# EAGLE schematic 8_RGB_SMD_LEDs (EAGLE 6.4)
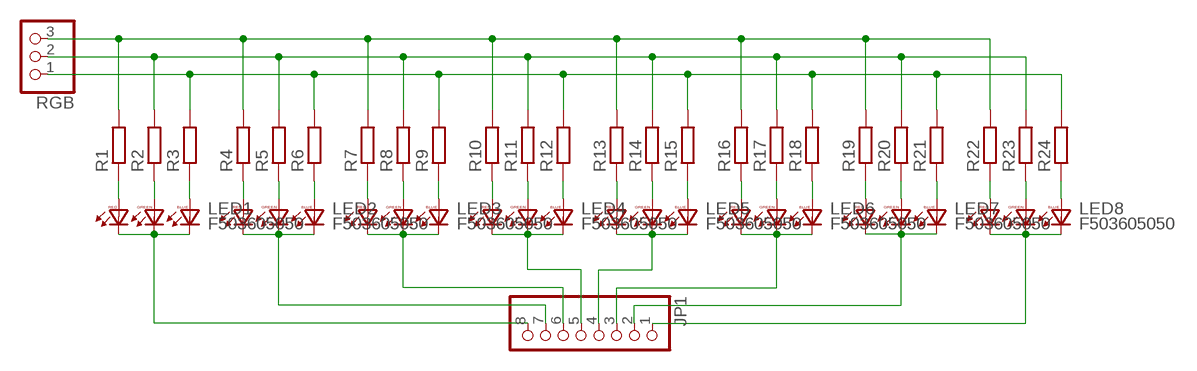
[diagram p0: schematic, sheet 1]

## Parts
JP1  PINHD-1X8  [1X08]
LED1  F503605050  [5050LED]
LED2  F503605050  [5050LED]
LED3  F503605050  [5050LED]
LED4  F503605050  [5050LED]
LED5  F503605050  [5050LED]
LED6  F503605050  [5050LED]
LED7  F503605050  [5050LED]
LED8  F503605050  [5050LED]
R1  R-EU_0207/7  [0207/7]
R2  R-EU_0207/7  [0207/7]
R3  R-EU_0207/7  [0207/7]
R4  R-EU_0207/7  [0207/7]
R5  R-EU_0207/7  [0207/7]
R6  R-EU_0207/7  [0207/7]
R7  R-EU_0207/7  [0207/7]
R8  R-EU_0207/7  [0207/7]
R9  R-EU_0207/7  [0207/7]
R10  R-EU_0207/7  [0207/7]
R11  R-EU_0207/7  [0207/7]
R12  R-EU_0207/7  [0207/7]
R13  R-EU_0207/7  [0207/7]
R14  R-EU_0207/7  [0207/7]
R15  R-EU_0207/7  [0207/7]
R16  R-EU_0207/7  [0207/7]
R17  R-EU_0207/7  [0207/7]
R18  R-EU_0207/7  [0207/7]
R19  R-EU_0207/7  [0207/7]
R20  R-EU_0207/7  [0207/7]
R21  R-EU_0207/7  [0207/7]
R22  R-EU_0207/7  [0207/7]
R23  R-EU_0207/7  [0207/7]
R24  R-EU_0207/7  [0207/7]
RGB  PINHD-1X3  [1X03]

## Nets
N$1: R1.2 R4.2 R7.2 R10.2 R13.2 R16.2 R19.2 R22.2 RGB.3
N$2: R2.2 R5.2 R8.2 R11.2 R14.2 R17.2 R20.2 R23.2 RGB.2
N$3: R3.2 R6.2 R9.2 R12.2 R15.2 R18.2 R21.2 R24.2 RGB.1
N$4: LED1.R1(RA) R1.1
N$5: LED1.G1(GA) R2.1
N$6: LED1.B1(BA) R3.1
N$7: JP1.8 LED1.B2(BC) LED1.G2(GC) LED1.R2(RC)
N$8: JP1.7 LED2.B2(BC) LED2.G2(GC) LED2.R2(RC)
N$9: JP1.6 LED3.B2(BC) LED3.G2(GC) LED3.R2(RC)
N$10: JP1.5 LED4.B2(BC) LED4.G2(GC) LED4.R2(RC)
N$11: LED2.R1(RA) R4.1
N$12: LED2.G1(GA) R5.1
N$13: LED2.B1(BA) R6.1
N$14: JP1.4 LED5.B2(BC) LED5.G2(GC) LED5.R2(RC)
N$15: JP1.3 LED6.B2(BC) LED6.G2(GC) LED6.R2(RC)
N$16: JP1.2 LED7.B2(BC) LED7.G2(GC) LED7.R2(RC)
N$17: JP1.1 LED8.B2(BC) LED8.G2(GC) LED8.R2(RC)
N$18: LED3.R1(RA) R7.1
N$19: LED3.G1(GA) R8.1
N$20: LED3.B1(BA) R9.1
N$21: LED4.R1(RA) R10.1
N$22: LED4.G1(GA) R11.1
N$23: LED4.B1(BA) R12.1
N$24: LED5.R1(RA) R13.1
N$25: LED5.G1(GA) R14.1
N$26: LED5.B1(BA) R15.1
N$27: LED6.R1(RA) R16.1
N$28: LED6.G1(GA) R17.1
N$29: LED6.B1(BA) R18.1
N$30: LED7.R1(RA) R19.1
N$31: LED7.G1(GA) R20.1
N$32: LED7.B1(BA) R21.1
N$33: LED8.R1(RA) R22.1
N$34: LED8.G1(GA) R23.1
N$35: LED8.B1(BA) R24.1

## Library data of the parts
JP1 = pinhead:PINHD-1X8: PIN HEADER
LED1-LED8 = BEEP:F50360: Full color Z-Power LED RGB P5-II Series Source: http://www.seoulsemicon.co.kr .. F50360.pdf
R1-R24 = rcl:R-EU_: RESISTOR, European symbol
RGB = pinhead:PINHD-1X3: PIN HEADER